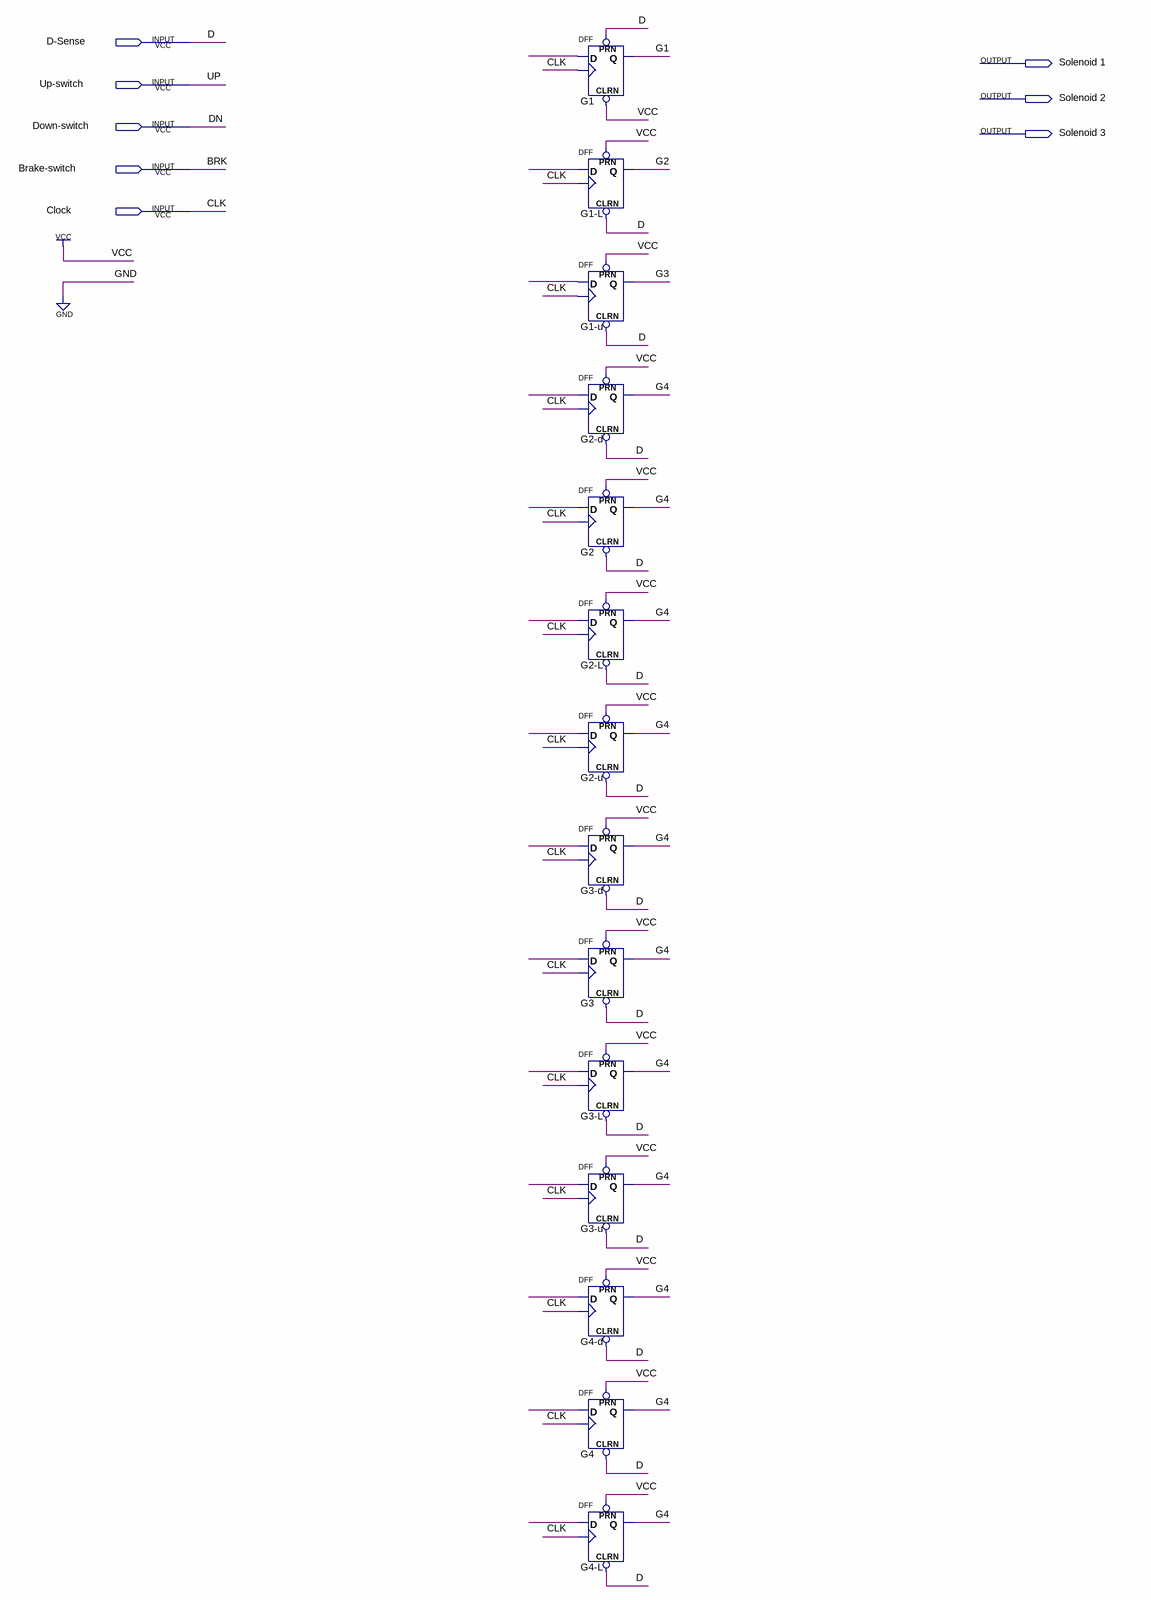
[diagram p0: schematic sheet]
// Quartus schematic top_level.bdf as structural Verilog: 14 symbols, 8 pins
module top_level (
  input  \D-Sense ,
  input  \Up-switch ,
  input  \Down-switch ,
  input  \Brake-switch ,
  input  Clock,
  output \Solenoid_1 ,
  output \Solenoid_2 ,
  output \Solenoid_3 
);

  wire G1, G2, G3, G4, undriven, undriven_2, undriven_3, undriven_4, undriven_5, undriven_6, undriven_7,
       undriven_8, undriven_9, undriven_10, undriven_11, undriven_12, undriven_13, undriven_14;

  DFF u_G1 (.CLRN(1'b1), .CLK(Clock), .D(undriven), .PRN(\D-Sense ), .Q(G1));
  DFF \G1-L  (.CLRN(\D-Sense ), .CLK(Clock), .D(undriven_2), .PRN(1'b1), .Q(G2));
  DFF \G1-u  (.CLRN(\D-Sense ), .CLK(Clock), .D(undriven_3), .PRN(1'b1), .Q(G3));
  DFF \G2-d  (.CLRN(\D-Sense ), .CLK(Clock), .D(undriven_4), .PRN(1'b1), .Q(G4));
  DFF u_G2 (.CLRN(\D-Sense ), .CLK(Clock), .D(undriven_5), .PRN(1'b1), .Q(G4));
  DFF \G2-L  (.CLRN(\D-Sense ), .CLK(Clock), .D(undriven_6), .PRN(1'b1), .Q(G4));
  DFF \G2-u  (.CLRN(\D-Sense ), .CLK(Clock), .D(undriven_7), .PRN(1'b1), .Q(G4));
  DFF \G3-d  (.CLRN(\D-Sense ), .CLK(Clock), .D(undriven_8), .PRN(1'b1), .Q(G4));
  DFF u_G3 (.CLRN(\D-Sense ), .CLK(Clock), .D(undriven_9), .PRN(1'b1), .Q(G4));
  DFF \G3-L  (.CLRN(\D-Sense ), .CLK(Clock), .D(undriven_10), .PRN(1'b1), .Q(G4));
  DFF \G3-u  (.CLRN(\D-Sense ), .CLK(Clock), .D(undriven_11), .PRN(1'b1), .Q(G4));
  DFF \G4-d  (.CLRN(\D-Sense ), .CLK(Clock), .D(undriven_12), .PRN(1'b1), .Q(G4));
  DFF u_G4 (.CLRN(\D-Sense ), .CLK(Clock), .D(undriven_13), .PRN(1'b1), .Q(G4));
  DFF \G4-L  (.CLRN(\D-Sense ), .CLK(Clock), .D(undriven_14), .PRN(1'b1), .Q(G4));

  // Other names for the same wires on the sheet: BRK = \Brake-switch ; CLK = Clock; D = \D-Sense ; DN = \Down-switch ;
  //   UP = \Up-switch 
endmodule
